# EasyEDA Pro project ProPrj_VE7GGH CW USB TRS_2026-06-29.epro

# Schematic Schematic1
Board Name: Board1; Create Date: 2026-05-20; Page Name: P1; Project Name: VE7GGH CW USB TRS; Schematic Name: Schematic1; Update Date: 2026-05-26; Company: EasyEDA.com; Drawed: VE7GGH; Drawn: VE7GGH; Page Size: A3; Part Number: JLCPCB-001; Reviewed: VE7GGH; Version: V1.0
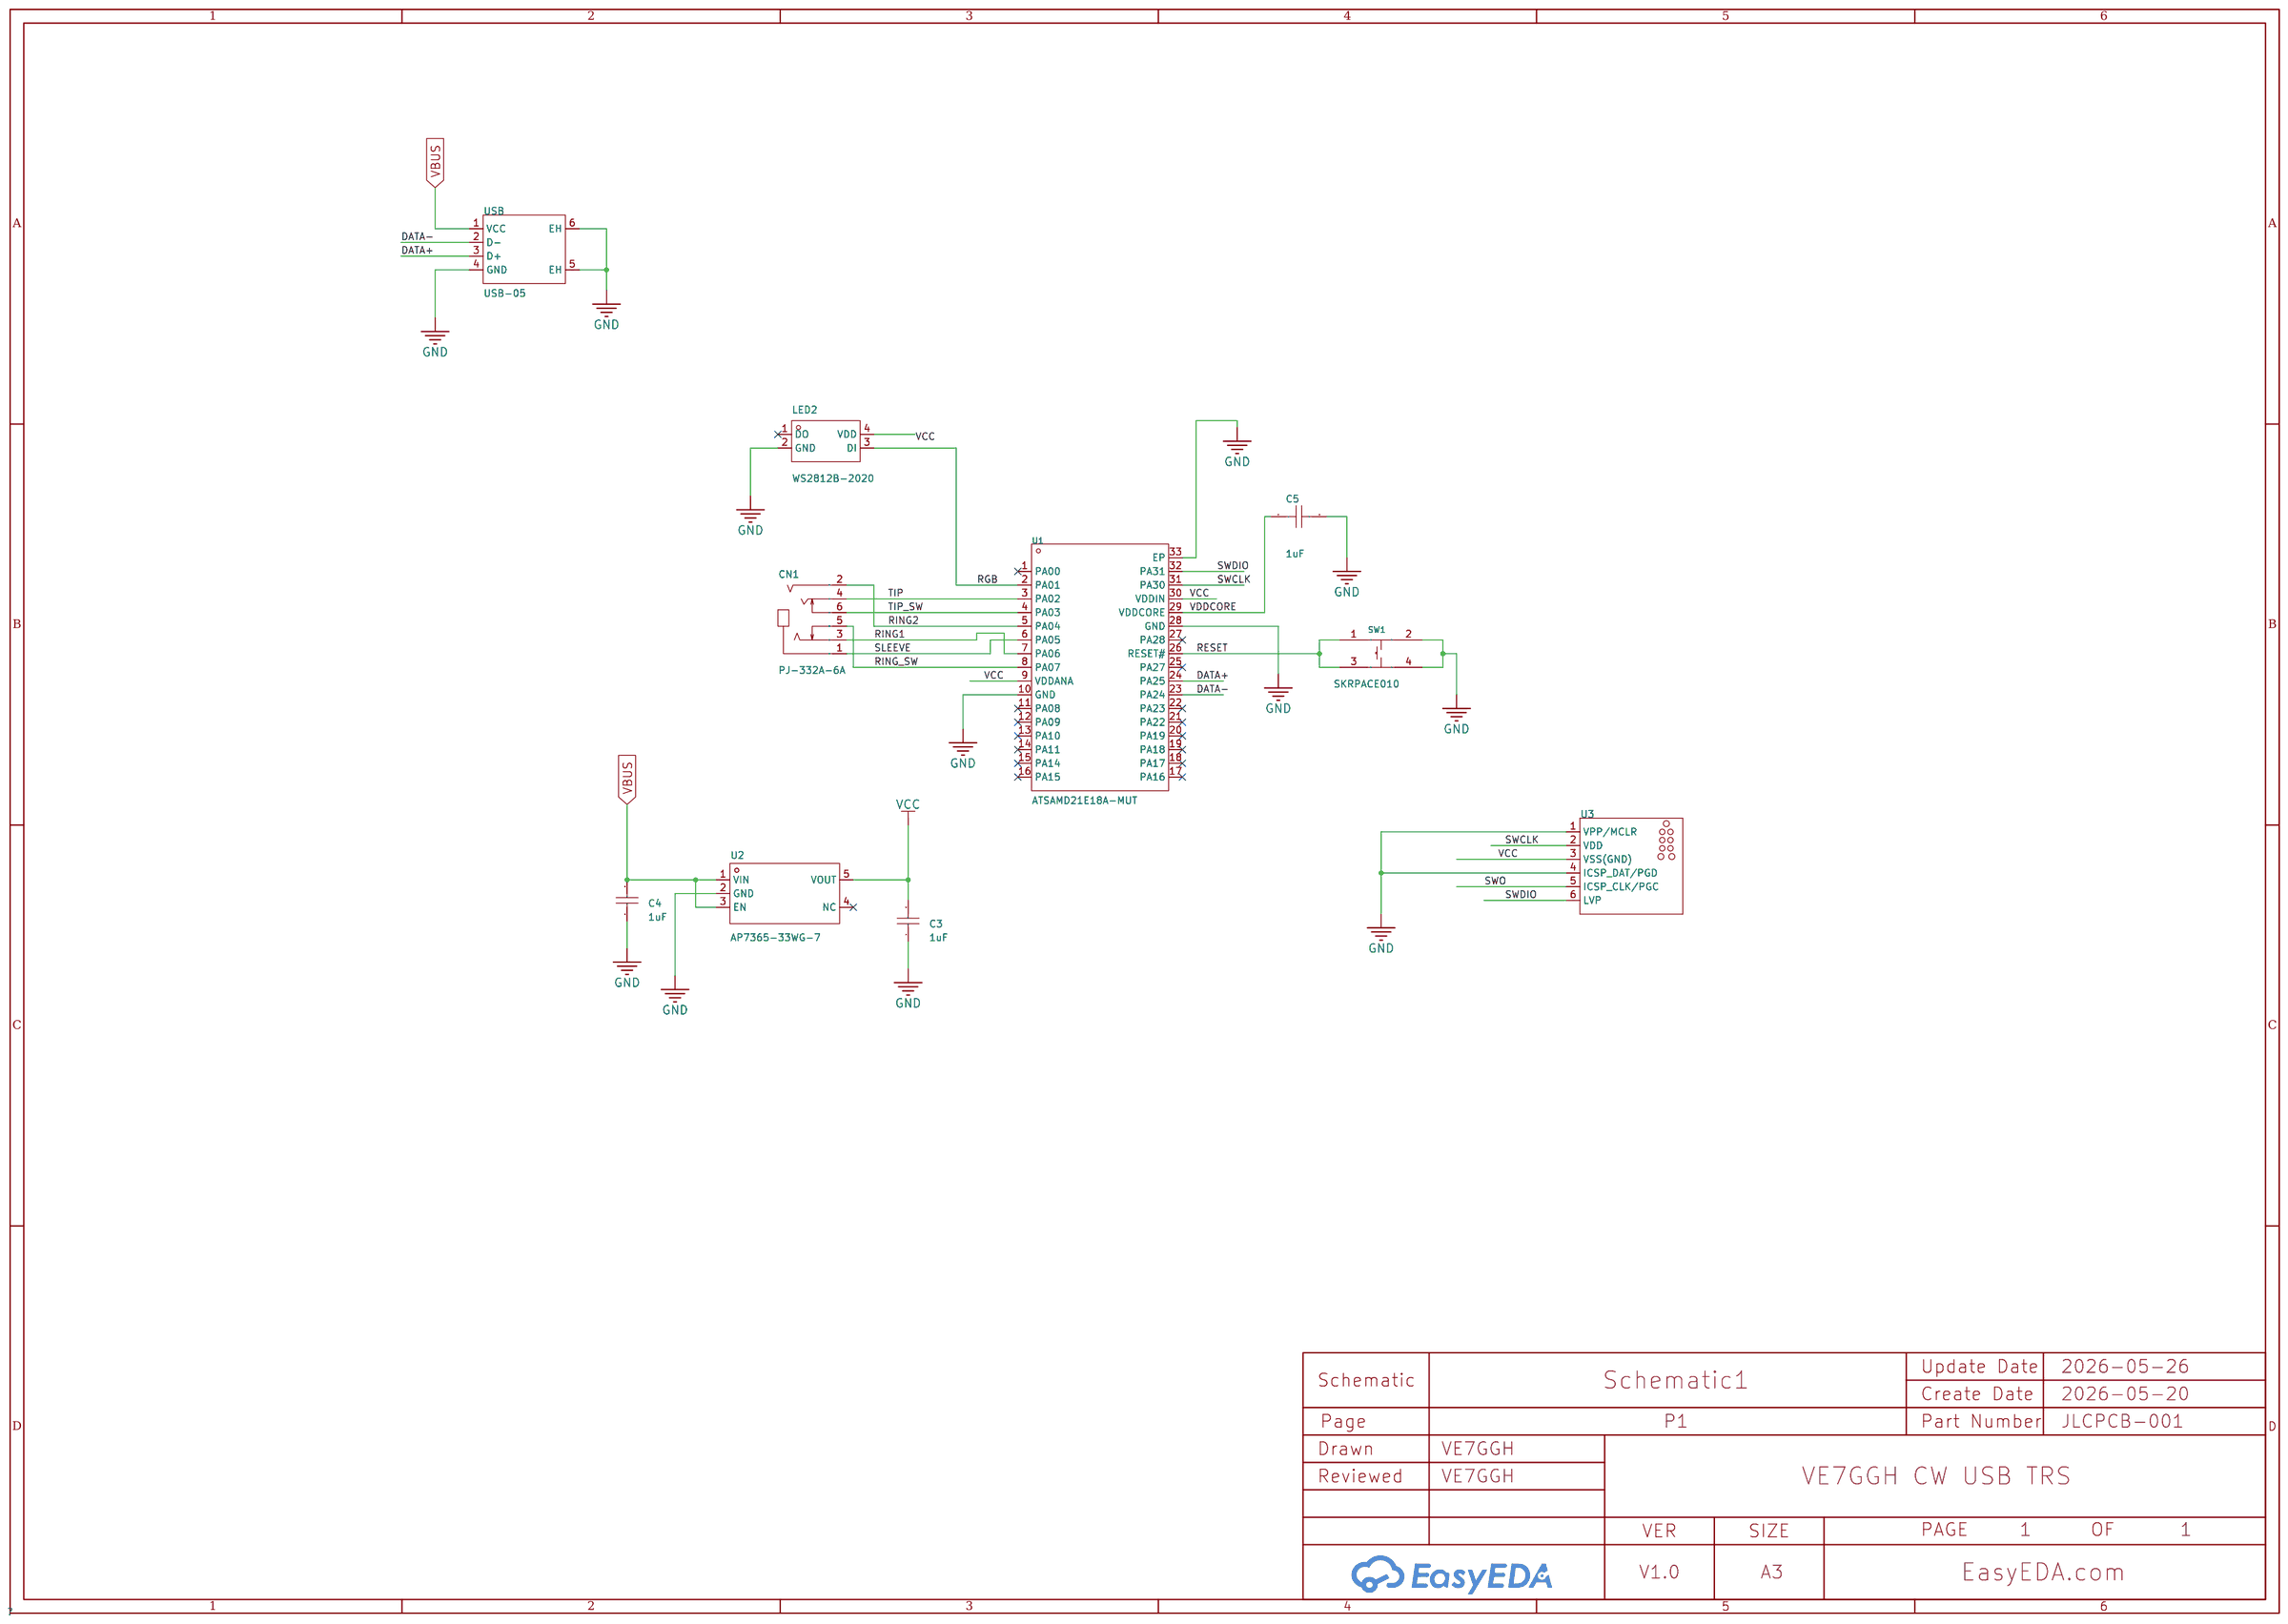
[diagram p0: schematic sheet]

## Parts
C3  1uF  [C0603]
C4  1uF  [C0603]
C5  1uF  [C0603]
CN1  PJ-332A-6A  [AUDIO-SMD_PJ-332A-6A]
LED2  WS2812B-2020  [LED-SMD_4P-L2.0-W2.0-TL_WS2812B-2020]
SW1  SKRPACE010  [KEY-SMD_4P-L4.2-W3.2-P2.20-LS4.6]
U1  ATSAMD21E18A-MUT  [QFN-32_L5.0-W5.0-P0.50-TL-EP3.6]
U2  AP7365-33WG-7  [SOT-25_L3.0-W1.6-P0.95-LS2.8-BR]
U3  -  [TC2030]
USB  USB-05  [USB-A-TH_USB-05]

## Library data of the parts
C3 C4 = CC0603KRX5R6BB105: Capacitance:1uF Tolerance:±10% Tolerance:±10% Voltage Rating:10V Temperature Coefficient:X5R; LCSC Part Name: 1uF ±10% 10V; Supplier Part: C106214; Manufacturer: YAGEO(国巨); Supplier Footprint: 0603; JLCPCB Part Class: Extended Part; Datasheet: https://item.szlcsc.com/datasheet/CC0603KRX5R6BB105/107429.html; Supplier: LCSC; Tolerance: ±10%; Voltage Rating: 10V; Temperature Coefficient: X5R
C5 = CC0603KRX7R9BB105: Capacitance:1uF Tolerance:±10% Tolerance:±10% Voltage Rating:50V Temperature Coefficient:X7R; LCSC Part Name: 1uF ±10% 50V; Supplier Part: C559769; Manufacturer: YAGEO(国巨); Supplier Footprint: 0603; JLCPCB Part Class: Extended Part; Datasheet: https://item.szlcsc.com/datasheet/CC0603KRX7R9BB105/584032.html; Supplier: LCSC; Tolerance: ±10%; Voltage Rating: 50V; Temperature Coefficient: X7R
CN1 = PJ-332A-6A: Connector Type:3.5mm Headphone Jack Current Rating:1A Voltage Rating (Max):30V Operating Temperature:-25℃~+80℃ Operating Temperature:-25℃~+80℃; LCSC Part Name: 3.5mm耳机座; Supplier Part: C2848643; Manufacturer: 韩国韩荣; Supplier Footprint: SMD; JLCPCB Part Class: Extended Part; Datasheet: https://item.szlcsc.com/datasheet/PJ-332A-6A/3047164.html; Supplier: LCSC; Connector Type: 3.5mm Headphone Jack; Current Rating: 1A; Voltage Rating (Max): 30V; Operating Temperature: -25℃~+80℃
LED2 = WS2812B-2020: Wavelength:515.6nm；622.5nm；470.4nm Luminous Intensity:200mcd；160mcd；520mcd Fixed-Frequency Pwm Mode:- Data Transmission Rate:100KB/S Voltage - Supply:5V Voltage - Supply:5V Quiescent Current:- Lens Color:- ESD Withstand Voltage:- Installation method:op Vi; LCSC Part Name: RGB三色; Supplier Part: C965555; Manufacturer: worldsemi; Supplier Footprint: SMD,2.2x2mm; JLCPCB Part Class: Extended Part; Datasheet: https://item.szlcsc.com/datasheet/WS2812B-2020/1051115.html; Supplier: LCSC; Wavelength: 515.6nm；622.5nm；470.4nm; Luminous Intensity: 200mcd；160mcd；520mcd; Data Transmission Rate: 100KB/S; Voltage - Supply: 5V; Installation method: op View Mount
SW1 = SKRPACE010: Circuit:SPST Actuator Style:Oval Button Mounting Type:Surface Mount,Vertical Length:4.2mm Width:3.2mm Switch Height:2.5mm Contact Current:50mA Voltage Rating:16V With Lamp:- Life:-; LCSC Part Name: 4.2*3.2*2.5mm 立贴 轻触开关; Supplier Part: C139797; Manufacturer: ALPSALPINE(阿尔卑斯阿尔派); Supplier Footprint: SMD-4P,4.2x3.2mm; JLCPCB Part Class: Extended Part; Datasheet: https://item.szlcsc.com/datasheet/SKRPACE010/151122.html; Supplier: LCSC; Circuit: SPST; Actuator Style: Oval Button; Mounting Type: Surface Mount,Vertical; Length: 4.2mm; Width: 3.2mm; Switch Height: 2.5mm; Contact Current: 50mA; Voltage Rating: 16V
U1 = ATSAMD21E18A-MUT: CPU Core:ARM Cortex-M0+ CPU Maximum Speed:48MHz Core Size:32 Bit Program Storage Size:256KB Program Memory Type:FLASH RAM Size:32KB EEPROM:- Number of I/O:26 ADC (Bit):12bit DAC (Bit):10bit Oscillator Type:Built-in Voltage - Supply:1.62V~3.6V Voltage - Su; LCSC Part Name: 低功耗、带先进模拟电路和PWM的32位Cortex-M0+微控制器; Supplier Part: C2052801; Manufacturer: MICROCHIP(美国微芯); Supplier Footprint: QFN-32-EP(5x5); JLCPCB Part Class: Extended Part; Datasheet: https://item.szlcsc.com/datasheet/ATSAMD21E18A-MUT/2144370.html; Supplier: LCSC; CPU Core: ARM Cortex-M0+; CPU Maximum Speed: 48MHz; Core Size: 32 Bit; Program Storage Size: 256KB; Program Memory Type: FLASH; RAM Size: 32KB; Number of I/O: 26; ADC (Bit): 12bit; DAC (Bit): 10bit; Oscillator Type: Built-in; Voltage - Supply: 1.62V~3.6V; Operating Temperature: -40℃~+85℃
U2 = AP7365-33WG-7: Output Type:Fixed Voltage - Supply:6V Output Voltage:3.3V Output Voltage:3.3V Output Current:600mA Power Supply Rejection Ratio (PSRR):65dB@(1kHz) Voltage Dropout:400mV@(600mA) standby current:300uA Features:Short Circuit Protection；Over Temperature Prote; LCSC Part Name: 输入6V 输出3.3V 600mA; Supplier Part: C150742; Manufacturer: DIODES(美台); Supplier Footprint: SOT-25; JLCPCB Part Class: Extended Part; Datasheet: https://item.szlcsc.com/datasheet/AP7365-33WG-7/162082.html; Supplier: LCSC; Output Type: Fixed; Voltage - Supply: 6V; Output Voltage: 3.3V; Output Current: 600mA; Power Supply Rejection Ratio (PSRR): 65dB@(1kHz); Voltage Dropout: 400mV@(600mA); standby current: 300uA; Features: Short Circuit Protection；Over Temperature Protection；Over Current Protection；Enable; Operating Temperature: -40℃~+85℃@(Ta); Output Configuration: Positive; Number of Outputs: 1
U3 = TC2030_-MCP-NL
USB = USB-05: Connector Type:Type-A Protocol Standard:USB 2.0 Gender:Male Mounting Type:Right Angle Number of Contacts:4P Number of Ports:1 Current Rating-Power:1A Voltage Rating:24V Length:18.75mm Operating Temperature:-35℃~+75℃ Operating Temperature:-35℃~+75℃; LCSC Part Name: Type-A 公 弯插; Supplier Part: C112454; Manufacturer: SOFNG(硕方); Supplier Footprint: 插件; JLCPCB Part Class: Extended Part; Datasheet: https://item.szlcsc.com/datasheet/USB-05/113687.html; Supplier: LCSC; Connector Type: Type-A; Protocol Standard: USB 2.0; Gender: Male; Mounting Type: Right Angle; Number of Contacts: 4P; Number of Ports: 1; Current Rating-Power: 1A; Voltage Rating: 24V; Length: 18.75mm; Operating Temperature: -35℃~+75℃

## Nets
GND: C3.1 C4.1 C5.2 LED2.2(GND) SW1.2 SW1.4 U1.10(GND) U1.28(GND) U1.33(EP) U2.2(GND) U3.1(VPP/MCLR) U3.4(ICSP_DAT/PGD) USB.4(GND) USB.5(EH) USB.6(EH)
VBUS: C4.2 U2.1(VIN) U2.3(EN) USB.1(VCC)
VCC: C3.2 LED2.4(VDD) U1.9(VDDANA) U1.30(VDDIN) U2.5(VOUT) U3.3(VSS(GND))
VDDCORE: C5.1 U1.29(VDDCORE)
DATA+: U1.24(PA25) USB.3(D+)
DATA-: U1.23(PA24) USB.2(D-)
RESET: SW1.1 SW1.3 U1.26(RESET#)
RGB: LED2.3(DI) U1.2(PA01)
RING1: CN1.3 U1.7(PA06)
RING2: CN1.2 U1.5(PA04)
RING_SW: CN1.5 U1.8(PA07)
SLEEVE: CN1.1 U1.6(PA05)
SWCLK: U1.31(PA30) U3.2(VDD)
SWDIO: U1.32(PA31) U3.6(LVP)
SWO: U3.5(ICSP_CLK/PGC)
TIP: CN1.4 U1.3(PA02)
TIP_SW: CN1.6 U1.4(PA03)

Not connected (* = marked no-connect by the designer): LED2 1(DO)*; U1 1(PA00)* 11(PA08)* 12(PA09)* 13(PA10)* 14(PA11)* 15(PA14)* 16(PA15)* 17(PA16)* 18(PA17)* 19(PA18)* 20(PA19)* 21(PA22)* 22(PA23)* 25(PA27)* 27(PA28)*; U2 4(NC)*

# Board PCB1
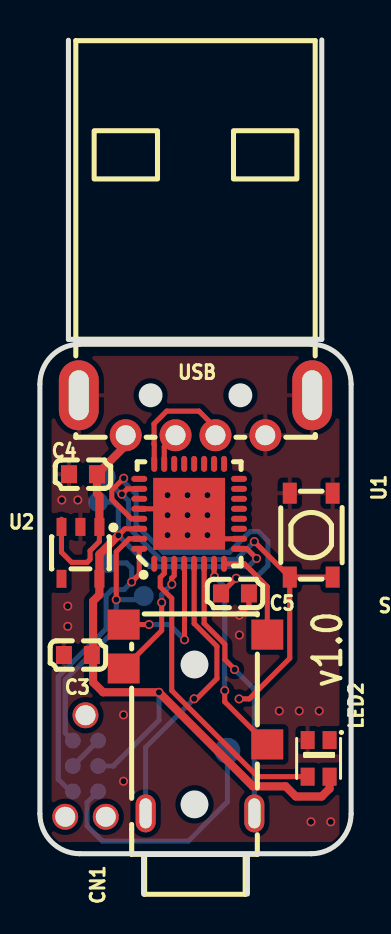
[diagram p1: board, top side]
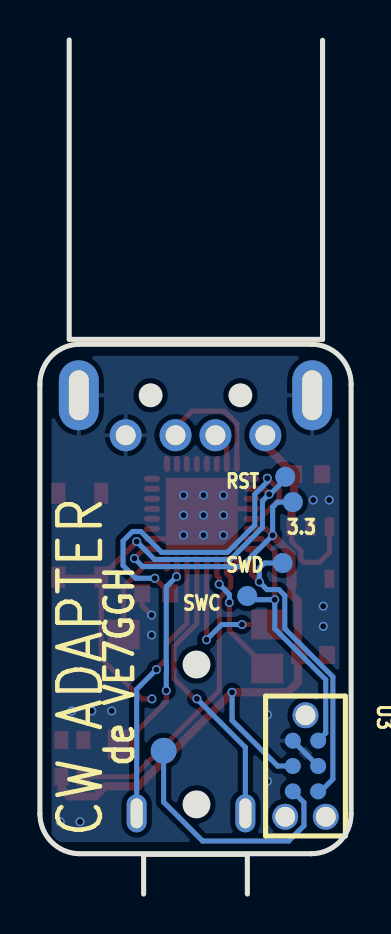
[diagram p2: board, bottom side, seen from below]

Outline 15.6 x 42.75 mm; copper layers: Top Layer, Bottom Layer. Coordinates in mm from the lower left corner of the outline.
Outline path: 0,25.52 0,4.02 arc(0.59,2.6) 2,2.02 13.6,2.02 arc(15.01,2.6) 15.6,4.02 15.6,25.52 arc(15.01,26.93) 13.6,27.52 2,27.52 arc(0.59,26.93) 0,25.52
Stack: Top Layer 0.035mm / Dielectric1 1.51mm FR4 er 4.5 / Bottom Layer 0.035mm

## Design rules (mm)
template: Custom Config
spacing copperThickness1oz (default): track to track 0.102, other pairs 0.152 to 0.3
spacing copperThickness2oz: track to track 0.203, other pairs 0.152 to 0.3
track width copperThickness1oz (default): min 0.127, default 0.254, max 2.54
track width copperThickness2oz: min 0.203, default 0.254, max 2.54
differential pair differentialPair (default): width min 0.127, default 0.254, max 2.54; gap min 0.152, default 0.152
via viaSize (default): diameter min 0.45, default 0.45, max 10; hole min 0.3, default 0.305, max 6.3

## Placement (name value [footprint] x y rotation side)
C3  1uF  [C0603]  1.91 11.96 0 top
C4  1uF  [C0603]  2.16 21.01 0 top
C5  1uF  [C0603]  9.78 15.04 0 top
CN1  PJ-332A-6A  [AUDIO-SMD_PJ-332A-6A]  7.8 8.76 90 top
LED2  WS2812B-2020  [LED-SMD_4P-L2.0-W2.0-TL_WS2812B-2020]  13.97 6.79 270 top
NOREF  -  [Pad_e234]  2.92 19.62 0 top
NOREF#2  -  [Pad_e226]  5.21 14.92 0 top
NOREF#3  -  [Pad_e227]  3.43 16.57 0 top
NOREF#4  -  [Pad_e224]  3.3 20.89 0 top
NOREF#5  -  [Pad_e447]  9.4 7.17 270 top
SW1  SKRPACE010  [KEY-SMD_4P-L4.2-W3.2-P2.20-LS4.6]  13.6 17.96 90 top
U1  ATSAMD21E18A-MUT  [QFN-32_L5.0-W5.0-P0.50-TL-EP3.6]  7.48 19.03 90 top
U2  AP7365-33WG-7  [SOT-25_L3.0-W1.6-P0.95-LS2.8-BR]  2.03 17.08 90 top
U3  -  [TC2030]  2.29 6.41 270 bottom
USB  USB-05  [USB-A-TH_USB-05]  7.8 23.96 180 top

## Footprints (pads in the part's own frame, mm; a bottom-side part is the same pattern mirrored in y, then rotated)
AUDIO-SMD_PJ-332A-6A
  oval 1.9x1 hole 1.5x0.6: 1(-4.725,-2.95) 2(-4.725,2.5)
  rect 1.5x1.6 smd: 3(-1.275,-3.6) 4(2.525,3.6) 5(4.225,-3.6) 6(4.725,3.6)
C0603
  rect 0.8x0.9 smd: 1(-0.7,0) 2(0.7,0)
KEY-SMD_4P-L4.2-W3.2-P2.20-LS4.6
  rect 1.05x0.7 smd: 1(-2.1,1.075) 2(2.1,1.075) 3(-2.1,-1.075) 4(2.1,-1.075)
LED-SMD_4P-L2.0-W2.0-TL_WS2812B-2020
  rect 0.9x0.7 smd: 1(-0.915,0.55) 2(-0.915,-0.55) 3(0.915,-0.55) 4(0.915,0.55)
Pad_e224
  round 1 smd far side: 1(0,0)
Pad_e226
  round 1 smd far side: 1(0,0)
Pad_e227
  round 1 smd far side: 2(0,0)
Pad_e234
  round 1 smd far side: 1(0,0)
Pad_e447
  round 1.3 smd far side: 1(0,0)
QFN-32_L5.0-W5.0-P0.50-TL-EP3.6
  oval 0.8x0.299 smd: 1(-2.5,1.75) 2(-2.5,1.25) 3(-2.5,0.75) 4(-2.5,0.25) 5(-2.5,-0.25) 6(-2.5,-0.75) 7(-2.5,-1.25) 8(-2.5,-1.75) 17(2.5,-1.75) 18(2.5,-1.25) 19(2.5,-0.75) 20(2.5,-0.25) 21(2.5,0.25) 22(2.5,0.75) 23(2.5,1.25) 24(2.5,1.75)
  oval 0.3x0.8 smd: 9(-1.75,-2.5) 10(-1.25,-2.5) 11(-0.75,-2.5) 12(-0.25,-2.5) 13(0.25,-2.5) 14(0.75,-2.5) 15(1.25,-2.5) 16(1.75,-2.5) 25(1.75,2.5) 26(1.25,2.5) 27(0.75,2.5) 28(0.25,2.5) 29(-0.25,2.5) 30(-0.75,2.5) 31(-1.25,2.5) 32(-1.75,2.5)
  rect 3.6x3.6 smd: 33(0,0)
SOT-25_L3.0-W1.6-P0.95-LS2.8-BR
  rect 0.9x0.5 smd: 1(1.3,-0.95) 2(1.3,0) 3(1.3,0.95) 4(-1.3,0.95) 5(-1.3,-0.95)
TC2030
  round 0.8 smd: 1(-1.27,-0.635) 2(-1.27,0.635) 3(0,-0.635) 4(0,0.635) 5(1.27,-0.635) 6(1.27,0.635)
  round 1.3 hole 1: 7(-2.54,0) 8(2.54,1.016) 9(2.54,-1.016)
USB-A-TH_USB-05
  round 1.6 hole 1: 1(3.5,1) 2(1,1) 3(-1,1) 4(-3.5,1)
  oval 2x3.5 hole 1x2.5: 5(-5.85,-1) 6(5.85,-1)

## Nets
GND: C3.1 C4.1 C5.2 LED2.2 SW1.2 SW1.4 U1.10 U1.28 U1.33 U2.2 U3.1 U3.4 USB.4 USB.5 USB.6
VBUS: C4.2 U2.1 U2.3 USB.1
VCC: C3.2 LED2.4 NOREF.1 U1.9 U1.30 U2.5 U3.3
VDDCORE: C5.1 U1.29
DATA+: U1.24 USB.3
DATA-: U1.23 USB.2
RESET: NOREF#4.1 SW1.1 SW1.3 U1.26
RGB: LED2.3 U1.2
RING1: CN1.3 U1.7
RING2: CN1.2 U1.5
RING_SW: CN1.5 U1.8
SLEEVE: CN1.1 U1.6
SWCLK: NOREF#2.1 U1.31 U3.2
SWDIO: NOREF#3.2 U1.32 U3.6
SWO: NOREF#5.1 U3.5
TIP: CN1.4 U1.3
TIP_SW: CN1.6 U1.4

Pads without a net: LED2 1; U1 1 11 12 13 14 15 16 17 18 19 20 21 22 25 27; U2 4; U3 7 8 9

## Via types
v1: diameter 0.45, hole 0.305, Top Layer to Bottom Layer, 40 vias

## Routing (per net, layer and track width the routed paths; a pad name or vN(x,y) marks a point on that pad's centre or on a via; arc(x,y) is an arc through that point)
GND: length 8.7
  Top Layer w0.254: 4.98,19.28 7.23,19.28 U1.33 8.73,17.78 U1.10 ; 10.48,15.04 10.48,14.44 v1(10,13.96)
  Bottom Layer w0.254: 2.92,7.68 U3.4
  vias: v1(1.1,19.72) v1(1.4,14.41) v1(1.4,13.4) v1(1.9,19.72) v1(4.19,8.97) v1(4.19,5.65) v1(6.4,19.96) v1(6.4,18.96) v1(6.4,17.96) v1(7.4,19.96) v1(7.4,18.96) v1(7.4,17.96) v1(8.4,19.96) v1(8.4,18.96) v1(8.4,17.96) v1(10,12.96) v1(12,9.16) v1(13,9.16) v1(13.59,3.61) v1(14,9.16) v1(14.58,3.61)
VBUS: length 10.4
  Top Layer w0.254: 1.08,18.76 1.08,17.11 1.59,16.6 2.36,16.6 2.51,16.75 2.51,17.18 2.98,17.65 U2.1
  Top Layer w0.406: USB.1 4.3,22.45 2.86,21.01 2.86,20.06 2.98,19.94 U2.1
VCC: length 40.8
  Top Layer w0.254: 4.98,18.28 4.26,18.28 v1(3.93,17.95) ; v1(10.86,16.8) 10.38,17.28 9.98,17.28
  Top Layer w0.406: 14.52,5.87 14.52,5.27 14.13,4.88 12.83,4.88 12.32,5.39 10.67,5.39 v1(5.97,10.1) 3.17,10.1 2.67,10.6 2.67,14.66 2.98,14.98 2.98,17 v1(3.93,17.95)
  Bottom Layer w0.254: v1(10.86,16.8) 10.45,16.39 5.5,16.39 v1(3.93,17.95) 3.93,19.36 3.68,19.62 3.05,19.62 2.92,19.74 ; v1(5.97,10.1) 5.97,8.69 3.68,6.41 U3.3
VDDCORE: length 17.6
  Top Layer w0.254: v1(9.84,15.81) C5.1 ; U1.29 4.58,18.78 3.61,19.76 3.61,20.22 v1(4.2,20.81)
  Bottom Layer w0.254: v1(9.84,15.81) 10.79,15.81 11.43,16.44 11.43,17.67 10.96,18.15 10.54,18.15 9.49,17.1 6.19,17.1 4.83,18.47 4.83,20.01 4.2,20.63 v1(4.2,20.81)
DATA+: length 6.1
  Top Layer w0.254: U1.24 5.73,22.51 5.72,22.52 5.72,23.54 6.35,24.17 7.97,24.17 8.8,23.34 USB.3
DATA-: length 1.7
  Top Layer w0.254: USB.2 6.23,22.4 U1.23
RESET: length 23.4
  Top Layer w0.254: SW1.1 14.68,15.86 ; SW1.1 v1(10.75,17.64) ; SW1.1 12.53,11.8 10.49,9.77 v1(9.99,9.77) ; 4.98,20.28 4.38,20.28 v1(4.11,20.01)
  Bottom Layer w0.254: 3.3,20.76 4.05,20.01 v1(4.11,20.01) 4.44,19.67 4.44,18.35 6.05,16.75 9.85,16.75 v1(10.75,17.64)
RGB: length 15.3
  Top Layer w0.254: U1.2 6.23,16.04 6.03,15.84 6.03,15.38 6.61,14.8 6.61,10.18 10.92,5.87 13.42,5.87
RING1: length 10.2
  Top Layer w0.254: U1.7 8.73,15.94 8.75,15.92 v1(8.75,15.89) ; v1(9.27,10.18) 9.27,9.62 CN1.3
  Bottom Layer w0.254: v1(8.75,15.89) 9.27,15.37 9.27,11.45 9.26,11.44 9.26,11.03 9.27,11.02 v1(9.27,10.18)
RING2: length 14.5
  Top Layer w0.254: U1.5 7.73,13.54 8.88,12.4 8.88,10.79 7.86,9.77 v1(7.73,9.77)
  Bottom Layer w0.254: v1(7.73,9.77) 5.3,7.34 CN1.2
RING_SW: length 5
  Top Layer w0.254: CN1.5 11.4,15.38 10.25,16.53 U1.8
SLEEVE: length 13.5
  Top Layer w0.254: U1.6 8.23,13.54 9.27,12.5 9.27,11.74 9.76,11.25 v1(9.76,11.23)
  Bottom Layer w0.254: v1(9.76,11.23) 10.75,10.24 CN1.1
SWCLK: length 13.6
  Top Layer w0.254: v1(3.83,14.73) 3.83,17.13 4.47,17.78 U1.31
  Bottom Layer w0.254: NOREF#2.1 5.02,14.73 v1(3.83,14.73) 3.83,13.28 1.27,10.73 1.27,8.06 1.65,7.68
SWDIO: length 16.3
  Top Layer w0.254: v1(4.6,15.62) 4.98,16 4.98,17.28
  Bottom Layer w0.254: U3.6 1.52,5.14 0.91,5.75 0.91,10.87 3.32,13.28 3.32,14.94 3.62,15.24 4.22,15.24 v1(4.6,15.62) 4.6,16.31 4.35,16.57 3.62,16.57
SWO: length 12.7
  Bottom Layer w0.254: NOREF#5.1 9.4,4.61 7.44,2.66 3.13,2.66 2.37,3.42 2.37,4.58 U3.5
TIP: length 6.3
  Top Layer w0.254: CN1.4 6.1,13.19 v1(6.1,14.59) ; v1(6.61,15.51) 6.6,15.52 6.6,15.81 6.73,15.93 U1.3
  Bottom Layer w0.254: v1(6.1,14.59) 6.1,15 v1(6.61,15.51)
TIP_SW: length 7.2
  Top Layer w0.254: v1(7.25,12.73) 7.25,16.51 U1.4 ; CN1.6 v1(5.47,13.49)
  Bottom Layer w0.254: v1(7.25,12.73) 6.49,13.49 v1(5.47,13.49)

## Copper pours and planes (outline as drawn; the poured copper is in the pictures)
GND on Top Layer: 0.59,26.93 15.01,26.93 15.01,2.6 0.59,2.6
GND on Bottom Layer: 0.59,26.93 15.01,26.93 15.01,2.6 0.59,2.6

## Text on the board
Bottom Silkscreen Layer: 3.3 | RST | SWD | SWC | de VE7GGH | CW ADAPTER
Top Silkscreen Layer: v1.0
